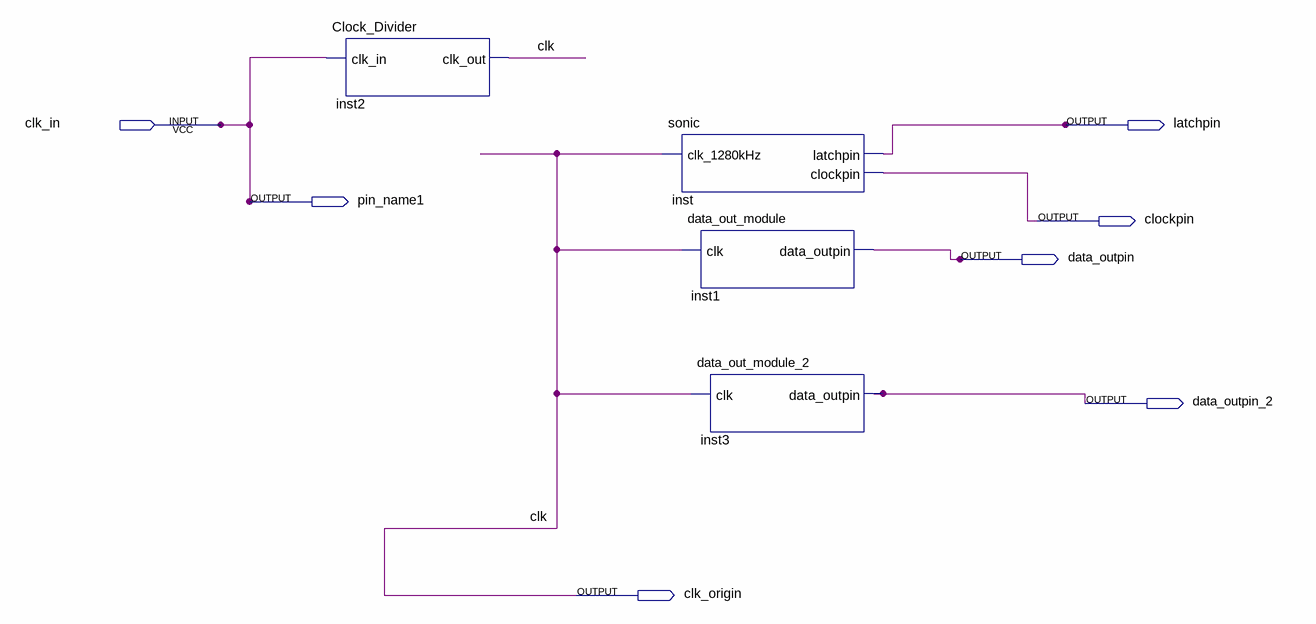
[diagram p0: schematic sheet]
// Quartus schematic Block1.bdf as structural Verilog: 4 symbols, 7 pins
module Block1 (
  input  clk_in,
  output latchpin,
  output pin_name1,
  output clockpin,
  output data_outpin,
  output data_outpin_2,
  output clk_origin
);

  Clock_Divider inst2 (.clk_in(clk_in), .clk_out(clk_origin));
  sonic inst (.clk_1280kHz(clk_origin), .latchpin(latchpin), .clockpin(clockpin));
  data_out_module inst1 (.clk(clk_origin), .data_outpin(data_outpin));
  data_out_module_2 inst3 (.clk(clk_origin), .data_outpin(data_outpin_2));

  assign pin_name1 = clk_in;

  // Other names for the same wires on the sheet: clk = clk_origin
endmodule
